# Altium project PCB_xc7z020_EvalBoard_01.PrjPcb
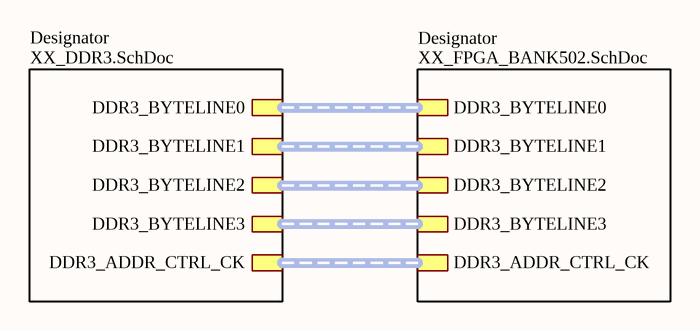
[diagram p0: 01_Main.SchDoc]
5 sheets, 51 parts. Net scope: hierarchical (ports join the sheet entries above them; power ports are global).
Board file: pcb-6layer-1oz-1.6mm.PcbDoc
Sheets:
  01_Main.SchDoc
    Designator = XX_DDR3.SchDoc
    Designator = XX_FPGA_BANK502.SchDoc
  XX_Power.SchDoc
  XX_FPGA.SchDoc

## Sheet 01_Main.SchDoc
size 594 x 420 mm; SheetNumber: 1; SheetTotal: 5

### Sub-sheets
Designator = XX_DDR3.SchDoc: DDR3_BYTELINE0 (harness DDR3_BYTELINE0), DDR3_BYTELINE1 (harness DDR3_BYTELINE1), DDR3_BYTELINE2 (harness DDR3_BYTELINE2), DDR3_BYTELINE3 (harness DDR3_BYTELINE3), DDR3_ADDR_CTRL_CK (harness DDR3_ADDR_CTRL_CK)
Designator = XX_FPGA_BANK502.SchDoc: DDR3_BYTELINE0 (harness DDR3_BYTELINE0), DDR3_BYTELINE1 (harness DDR3_BYTELINE1), DDR3_BYTELINE2 (harness DDR3_BYTELINE2), DDR3_BYTELINE3 (harness DDR3_BYTELINE3), DDR3_ADDR_CTRL_CK (harness DDR3_ADDR_CTRL_CK)

### Notes on the sheet
- Перв. примен.
- Справ. №
- Подп. и дата
- Инв. № дубл.
- Взам. инв. №
- Разраб.
- Изм.
- Лист
- № докум.
- Подп.
- Дата
- Лит.
- Масса
- Масштаб
- Пров.
- Т.контр.
- Листов
- Инв. № подл.
- Утв.
- Н.контр.
- 2.106-A2
- Копировал
- Формат А2

## Sheet XX_DDR3.SchDoc
size 594 x 420 mm; PageSetup: Record=PageOptions|CenterHorizontal=False|CenterVertical=False|PrintScale=0.95|XCorrection=0.00|YCorrection=0.00|PrintKind=1|BorderSize=5000000|LeftOffset=0|BottomOffset=0|Orientation=1|PaperLength=1000|PaperWidth=1000|Scale=100|PaperSource=15|PrintQuality=600|MediaType=1|DitherType=10|PaperKind=A4|PrintScaleMode=1; ESKD_Decimal_Number: {XXXX.XXXXXX.XXX}; Address1: Address1; Address2: Address2; Address3: Address3; Address4: Address4; DocumentNumber: АБВГ.123456.001 Э3; SheetNumber: 2; SheetTotal: 5; Scale: 1:1; DocumentType: Схема электрическая принципиальная; FirstReferrence: АБВГ.123456.001
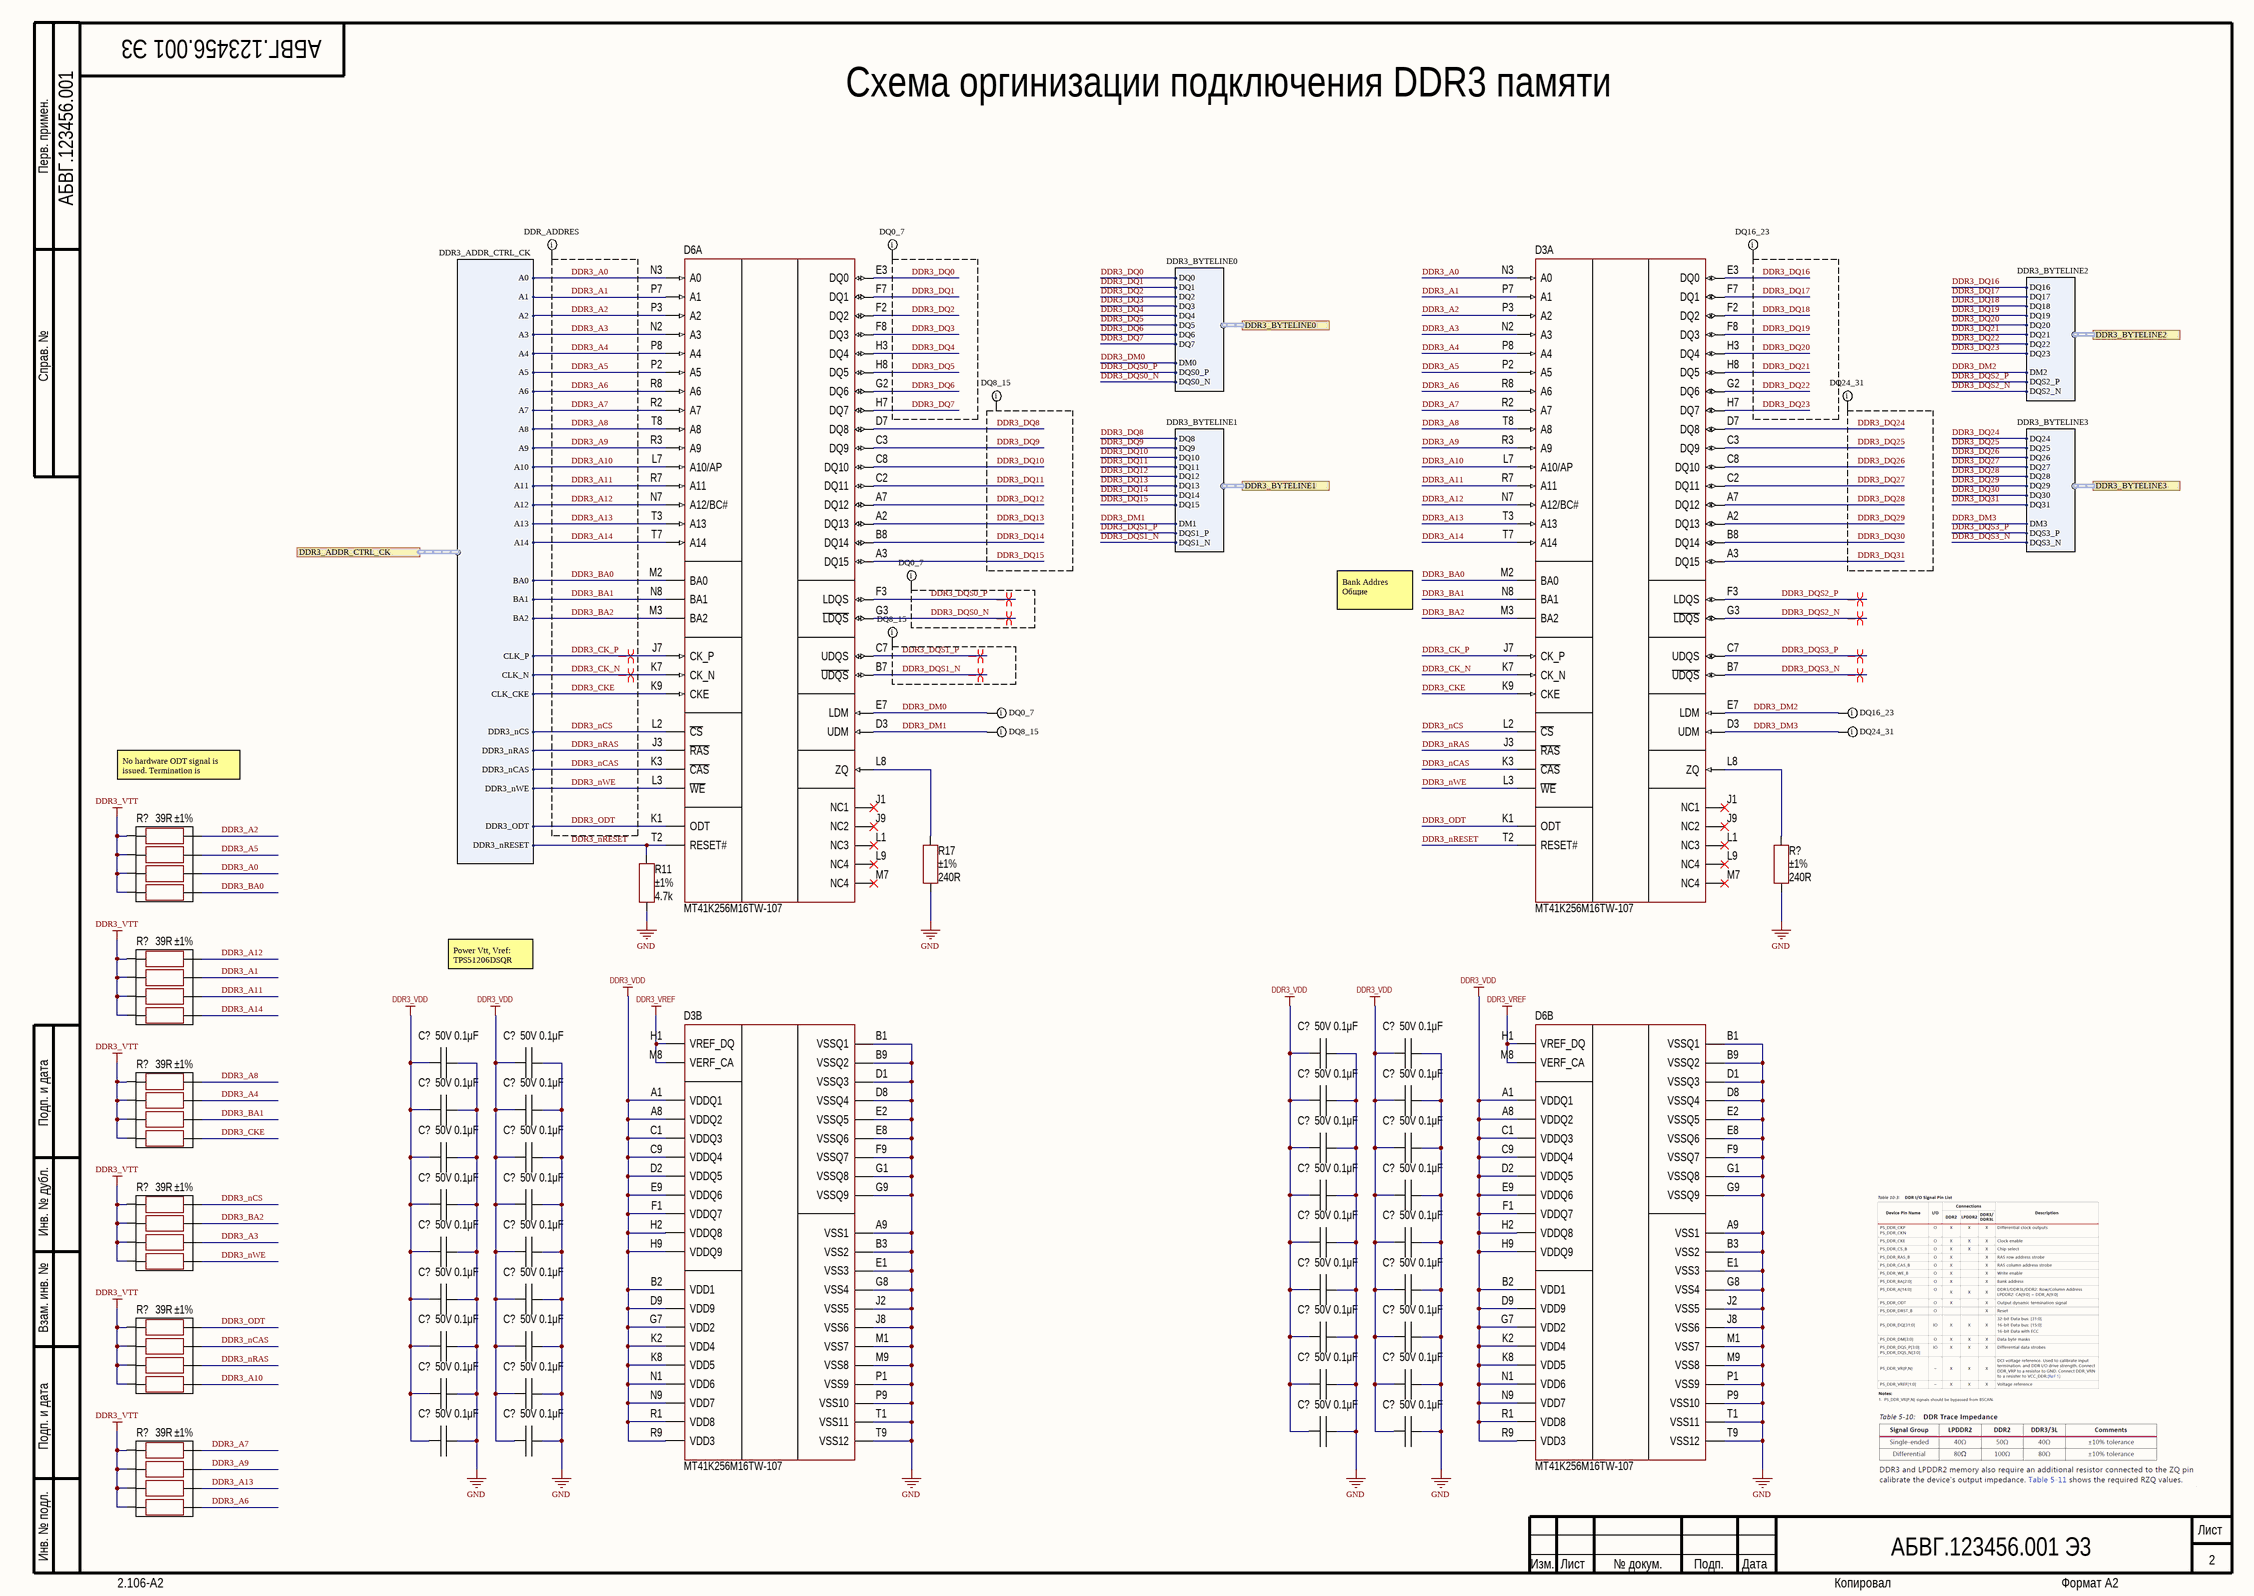
[diagram p1: XX_DDR3.SchDoc]

### Parts
(Parts that share a designator on the sheet are numbered #1, #2 ... from top to bottom, then left to right.)
C?#1  value 0.1μF  Voltage: 50V  [CAP: 0402]
C?#2  value 0.1μF  Voltage: 50V  [CAP: 0402]
C?#3  value 0.1μF  Voltage: 50V  [CAP: 0402]
C?#4  value 0.1μF  Voltage: 50V  [CAP: 0402]
C?#5  value 0.1μF  Voltage: 50V  [CAP: 0402]
C?#6  value 0.1μF  Voltage: 50V  [CAP: 0402]
C?#7  value 0.1μF  Voltage: 50V  [CAP: 0402]
C?#8  value 0.1μF  Voltage: 50V  [CAP: 0402]
C?#9  value 0.1μF  Voltage: 50V  [CAP: 0402]
C?#10  value 0.1μF  Voltage: 50V  [CAP: 0402]
C?#11  value 0.1μF  Voltage: 50V  [CAP: 0402]
C?#12  value 0.1μF  Voltage: 50V  [CAP: 0402]
C?#13  value 0.1μF  Voltage: 50V  [CAP: 0402]
C?#14  value 0.1μF  Voltage: 50V  [CAP: 0402]
C?#15  value 0.1μF  Voltage: 50V  [CAP: 0402]
C?#16  value 0.1μF  Voltage: 50V  [CAP: 0402]
C?#17  value 0.1μF  Voltage: 50V  [CAP: 0402]
C?#18  value 0.1μF  Voltage: 50V  [CAP: 0402]
C?#19  value 0.1μF  Voltage: 50V  [CAP: 0402]
C?#20  value 0.1μF  Voltage: 50V  [CAP: 0402]
C?#21  value 0.1μF  Voltage: 50V  [CAP: 0402]
C?#22  value 0.1μF  Voltage: 50V  [CAP: 0402]
C?#23  value 0.1μF  Voltage: 50V  [CAP: 0402]
C?#24  value 0.1μF  Voltage: 50V  [CAP: 0402]
C?#25  value 0.1μF  Voltage: 50V  [CAP: 0402]
C?#26  value 0.1μF  Voltage: 50V  [CAP: 0402]
C?#27  value 0.1μF  Voltage: 50V  [CAP: 0402]
C?#28  value 0.1μF  Voltage: 50V  [CAP: 0402]
C?#29  value 0.1μF  Voltage: 50V  [CAP: 0402]
C?#30  value 0.1μF  Voltage: 50V  [CAP: 0402]
C?#31  value 0.1μF  Voltage: 50V  [CAP: 0402]
C?#32  value 0.1μF  Voltage: 50V  [CAP: 0402]
C?#33  value 0.1μF  Voltage: 50V  [CAP: 0402]
C?#34  value 0.1μF  Voltage: 50V  [CAP: 0402]
C?#35  value 0.1μF  Voltage: 50V  [CAP: 0402]
C?#36  value 0.1μF  Voltage: 50V  [CAP: 0402]
D3  (no value)  [IC: FBGA96]  (parts A,B of 2)
D6  (no value)  [IC: FBGA96]  (parts A,B of 2)
R11  value 4.7k  Tolerance: ±1%  [RES: 0402]
R17  value 240R  Tolerance: ±1%  [RES: 0402]
R?#1  value 39R  Tolerance: ±1%
R?#2  value 240R  Tolerance: ±1%  [RES: 0402]
R?#3  value 39R  Tolerance: ±1%
R?#4  value 39R  Tolerance: ±1%
R?#5  value 39R  Tolerance: ±1%
R?#6  value 39R  Tolerance: ±1%
R?#7  value 39R  Tolerance: ±1%

### Ports
DDR3_ADDR_CTRL_CK (harness DDR3_ADDR_CTRL_CK), DDR3_BYTELINE0 (harness DDR3_BYTELINE0), DDR3_BYTELINE1 (harness DDR3_BYTELINE1), DDR3_BYTELINE2 (harness DDR3_BYTELINE2), DDR3_BYTELINE3 (harness DDR3_BYTELINE3)

### Harnesses
DDR3_BYTELINE0: DQ0, DQ1, DQ2, DQ3, DQ4, DQ5, DQ6, DQ7, DM0, DQS0_P, DQS0_N
DDR3_BYTELINE1: DQ8, DQ9, DQ10, DQ11, DQ12, DQ13, DQ14, DQ15, DM1, DQS1_P, DQS1_N
DDR3_BYTELINE2: DQ16, DQ17, DQ18, DQ19, DQ20, DQ21, DQ22, DQ23, DM2, DQS2_P, DQS2_N
DDR3_BYTELINE3: DQ24, DQ25, DQ26, DQ27, DQ28, DQ29, DQ30, DQ31, DM3, DQS3_P, DQS3_N
DDR3_ADDR_CTRL_CK: A0, A1, A2, A3, A4, A5, A6, A7, A8, A9, A10, A11, A12, A13, A14, BA0, BA1, BA2, CLK_P, CLK_N, CLK_CKE, DDR3_nCS, DDR3_nRAS, DDR3_nWE, DDR3_nCAS, DDR3_ODT, DDR3_nRESET

### Nets
DDR3_VDD: C?#1.2 C?#2.2 C?#3.2 C?#4.2 C?#5.2 C?#6.2 C?#7.2 C?#8.2 C?#9.2 C?#10.2 C?#11.2 C?#12.2 C?#13.2 C?#14.2 C?#15.2 C?#16.2 C?#17.2 C?#18.2 C?#19.2 C?#20.2 C?#21.2 C?#22.2 C?#23.2 C?#24.2 C?#25.2 C?#26.2 C?#27.2 C?#28.2 C?#29.2 C?#30.2 C?#31.2 C?#32.2 C?#33.2 C?#34.2 C?#35.2 C?#36.2 D3.A1(VDDQ1) D3.A8(VDDQ2) D3.B2(VDD1) D3.C1(VDDQ3) D3.C9(VDDQ4) D3.D2(VDDQ5) D3.D9(VDD9) D3.E9(VDDQ6) D3.F1(VDDQ7) D3.G7(VDD2) D3.H2(VDDQ8) D3.H9(VDDQ9) D3.K2(VDD4) D3.K8(VDD5) D3.N1(VDD6) D3.N9(VDD7) D3.R1(VDD8) D3.R9(VDD3) D6.A1(VDDQ1) D6.A8(VDDQ2) D6.B2(VDD1) D6.C1(VDDQ3) D6.C9(VDDQ4) D6.D2(VDDQ5) D6.D9(VDD9) D6.E9(VDDQ6) D6.F1(VDDQ7) D6.G7(VDD2) D6.H2(VDDQ8) D6.H9(VDDQ9) D6.K2(VDD4) D6.K8(VDD5) D6.N1(VDD6) D6.N9(VDD7) D6.R1(VDD8) D6.R9(VDD3)
DDR3_VREF: D3.H1(VREF_DQ) D3.M8(VERF_CA) D6.H1(VREF_DQ) D6.M8(VERF_CA)
DDR3_VTT: R?#1.1 R?#1.3 R?#1.5 R?#1.7 R?#3.1 R?#3.3 R?#3.5 R?#3.7 R?#4.1 R?#4.3 R?#4.5 R?#4.7 R?#5.1 R?#5.3 R?#5.5 R?#5.7 R?#6.1 R?#6.3 R?#6.5 R?#6.7 R?#7.1 R?#7.3 R?#7.5 R?#7.7
GND: C?#1.1 C?#2.1 C?#3.1 C?#4.1 C?#5.1 C?#6.1 C?#7.1 C?#8.1 C?#9.1 C?#10.1 C?#11.1 C?#12.1 C?#13.1 C?#14.1 C?#15.1 C?#16.1 C?#17.1 C?#18.1 C?#19.1 C?#20.1 C?#21.1 C?#22.1 C?#23.1 C?#24.1 C?#25.1 C?#26.1 C?#27.1 C?#28.1 C?#29.1 C?#30.1 C?#31.1 C?#32.1 C?#33.1 C?#34.1 C?#35.1 C?#36.1 D3.A9(VSS1) D3.B1(VSSQ1) D3.B3(VSS2) D3.B9(VSSQ2) D3.D1(VSSQ3) D3.D8(VSSQ4) D3.E1(VSS3) D3.E2(VSSQ5) D3.E8(VSSQ6) D3.F9(VSSQ7) D3.G1(VSSQ8) D3.G8(VSS4) D3.G9(VSSQ9) D3.J2(VSS5) D3.J8(VSS6) D3.M1(VSS7) D3.M9(VSS8) D3.P1(VSS9) D3.P9(VSS10) D3.T1(VSS11) D3.T9(VSS12) D6.A9(VSS1) D6.B1(VSSQ1) D6.B3(VSS2) D6.B9(VSSQ2) D6.D1(VSSQ3) D6.D8(VSSQ4) D6.E1(VSS3) D6.E2(VSSQ5) D6.E8(VSSQ6) D6.F9(VSSQ7) D6.G1(VSSQ8) D6.G8(VSS4) D6.G9(VSSQ9) D6.J2(VSS5) D6.J8(VSS6) D6.M1(VSS7) D6.M9(VSS8) D6.P1(VSS9) D6.P9(VSS10) D6.T1(VSS11) D6.T9(VSS12) R11.2 R17.2 R?#2.2
DDR3_A0: D3.N3(A0) D6.N3(A0) R?#1.6 ; port DDR3_ADDR_CTRL_CK.A0
DDR3_A1: D3.P7(A1) D6.P7(A1) R?#3.4 ; port DDR3_ADDR_CTRL_CK.A1
DDR3_A2: D3.P3(A2) D6.P3(A2) R?#1.2 ; port DDR3_ADDR_CTRL_CK.A2
DDR3_A3: D3.N2(A3) D6.N2(A3) R?#5.6 ; port DDR3_ADDR_CTRL_CK.A3
DDR3_A4: D3.P8(A4) D6.P8(A4) R?#4.4 ; port DDR3_ADDR_CTRL_CK.A4
DDR3_A5: D3.P2(A5) D6.P2(A5) R?#1.4 ; port DDR3_ADDR_CTRL_CK.A5
DDR3_A6: D3.R8(A6) D6.R8(A6) R?#7.8 ; port DDR3_ADDR_CTRL_CK.A6
DDR3_A7: D3.R2(A7) D6.R2(A7) R?#7.2 ; port DDR3_ADDR_CTRL_CK.A7
DDR3_A8: D3.T8(A8) D6.T8(A8) R?#4.2 ; port DDR3_ADDR_CTRL_CK.A8
DDR3_A9: D3.R3(A9) D6.R3(A9) R?#7.4 ; port DDR3_ADDR_CTRL_CK.A9
DDR3_A10: D3.L7(A10/AP) D6.L7(A10/AP) R?#6.8 ; port DDR3_ADDR_CTRL_CK.A10
DDR3_A11: D3.R7(A11) D6.R7(A11) R?#3.6 ; port DDR3_ADDR_CTRL_CK.A11
DDR3_A12: D3.N7(A12/BC#) D6.N7(A12/BC#) R?#3.2 ; port DDR3_ADDR_CTRL_CK.A12
DDR3_A13: D3.T3(A13) D6.T3(A13) R?#7.6 ; port DDR3_ADDR_CTRL_CK.A13
DDR3_A14: D3.T7(A14) D6.T7(A14) R?#3.8 ; port DDR3_ADDR_CTRL_CK.A14
DDR3_BA0: D3.M2(BA0) D6.M2(BA0) R?#1.8 ; port DDR3_ADDR_CTRL_CK.BA0
DDR3_BA1: D3.N8(BA1) D6.N8(BA1) R?#4.6 ; port DDR3_ADDR_CTRL_CK.BA1
DDR3_BA2: D3.M3(BA2) D6.M3(BA2) R?#5.4 ; port DDR3_ADDR_CTRL_CK.BA2
DDR3_CK_N: D3.K7(CK_N) D6.K7(CK_N) ; port DDR3_ADDR_CTRL_CK.CLK_N
DDR3_CK_P: D3.J7(CK_P) D6.J7(CK_P) ; port DDR3_ADDR_CTRL_CK.CLK_P
DDR3_CKE: D3.K9(CKE) D6.K9(CKE) R?#4.8 ; port DDR3_ADDR_CTRL_CK.CLK_CKE
DDR3_DM0: D6.E7(LDM) ; port DDR3_BYTELINE0.DM0
DDR3_DM1: D6.D3(UDM) ; port DDR3_BYTELINE1.DM1
DDR3_DM2: D3.E7(LDM) ; port DDR3_BYTELINE2.DM2
DDR3_DM3: D3.D3(UDM) ; port DDR3_BYTELINE3.DM3
DDR3_DQ0: D6.E3(DQ0) ; port DDR3_BYTELINE0.DQ0
DDR3_DQ1: D6.F7(DQ1) ; port DDR3_BYTELINE0.DQ1
DDR3_DQ2: D6.F2(DQ2) ; port DDR3_BYTELINE0.DQ2
DDR3_DQ3: D6.F8(DQ3) ; port DDR3_BYTELINE0.DQ3
DDR3_DQ4: D6.H3(DQ4) ; port DDR3_BYTELINE0.DQ4
DDR3_DQ5: D6.H8(DQ5) ; port DDR3_BYTELINE0.DQ5
DDR3_DQ6: D6.G2(DQ6) ; port DDR3_BYTELINE0.DQ6
DDR3_DQ7: D6.H7(DQ7) ; port DDR3_BYTELINE0.DQ7
DDR3_DQ8: D6.D7(DQ8) ; port DDR3_BYTELINE1.DQ8
DDR3_DQ9: D6.C3(DQ9) ; port DDR3_BYTELINE1.DQ9
DDR3_DQ10: D6.C8(DQ10) ; port DDR3_BYTELINE1.DQ10
DDR3_DQ11: D6.C2(DQ11) ; port DDR3_BYTELINE1.DQ11
DDR3_DQ12: D6.A7(DQ12) ; port DDR3_BYTELINE1.DQ12
DDR3_DQ13: D6.A2(DQ13) ; port DDR3_BYTELINE1.DQ13
DDR3_DQ14: D6.B8(DQ14) ; port DDR3_BYTELINE1.DQ14
DDR3_DQ15: D6.A3(DQ15) ; port DDR3_BYTELINE1.DQ15
DDR3_DQ16: D3.E3(DQ0) ; port DDR3_BYTELINE2.DQ16
DDR3_DQ17: D3.F7(DQ1) ; port DDR3_BYTELINE2.DQ17
DDR3_DQ18: D3.F2(DQ2) ; port DDR3_BYTELINE2.DQ18
DDR3_DQ19: D3.F8(DQ3) ; port DDR3_BYTELINE2.DQ19
DDR3_DQ20: D3.H3(DQ4) ; port DDR3_BYTELINE2.DQ20
DDR3_DQ21: D3.H8(DQ5) ; port DDR3_BYTELINE2.DQ21
DDR3_DQ22: D3.G2(DQ6) ; port DDR3_BYTELINE2.DQ22
DDR3_DQ23: D3.H7(DQ7) ; port DDR3_BYTELINE2.DQ23
DDR3_DQ24: D3.D7(DQ8) ; port DDR3_BYTELINE3.DQ24
DDR3_DQ25: D3.C3(DQ9) ; port DDR3_BYTELINE3.DQ25
DDR3_DQ26: D3.C8(DQ10) ; port DDR3_BYTELINE3.DQ26
DDR3_DQ27: D3.C2(DQ11) ; port DDR3_BYTELINE3.DQ27
DDR3_DQ28: D3.A7(DQ12) ; port DDR3_BYTELINE3.DQ28
DDR3_DQ29: D3.A2(DQ13) ; port DDR3_BYTELINE3.DQ29
DDR3_DQ30: D3.B8(DQ14) ; port DDR3_BYTELINE3.DQ30
DDR3_DQ31: D3.A3(DQ15) ; port DDR3_BYTELINE3.DQ31
DDR3_DQS0_N: D6.G3(~{LDQS}) ; port DDR3_BYTELINE0.DQS0_N
DDR3_DQS0_P: D6.F3(LDQS) ; port DDR3_BYTELINE0.DQS0_P
DDR3_DQS1_N: D6.B7(~{UDQS}) ; port DDR3_BYTELINE1.DQS1_N
DDR3_DQS1_P: D6.C7(UDQS) ; port DDR3_BYTELINE1.DQS1_P
DDR3_DQS2_N: D3.G3(~{LDQS}) ; port DDR3_BYTELINE2.DQS2_N
DDR3_DQS2_P: D3.F3(LDQS) ; port DDR3_BYTELINE2.DQS2_P
DDR3_DQS3_N: D3.B7(~{UDQS}) ; port DDR3_BYTELINE3.DQS3_N
DDR3_DQS3_P: D3.C7(UDQS) ; port DDR3_BYTELINE3.DQS3_P
DDR3_nCAS: D3.K3(~{CAS}) D6.K3(~{CAS}) R?#6.4 ; port DDR3_ADDR_CTRL_CK.DDR3_nCAS
DDR3_nCS: D3.L2(~{CS}) D6.L2(~{CS}) R?#5.2 ; port DDR3_ADDR_CTRL_CK.DDR3_nCS
DDR3_nRAS: D3.J3(~{RAS}) D6.J3(~{RAS}) R?#6.6 ; port DDR3_ADDR_CTRL_CK.DDR3_nRAS
DDR3_nRESET: D3.T2(RESET#) D6.T2(RESET#) R11.1 ; port DDR3_ADDR_CTRL_CK.DDR3_nRESET
DDR3_nWE: D3.L3(~{WE}) D6.L3(~{WE}) R?#5.8 ; port DDR3_ADDR_CTRL_CK.DDR3_nWE
DDR3_ODT: D3.K1(ODT) D6.K1(ODT) R?#6.2 ; port DDR3_ADDR_CTRL_CK.DDR3_ODT
NetD3_L8: D3.L8(ZQ) R?#2.1
NetD6_L8: D6.L8(ZQ) R17.1

Not connected (* = marked no-connect by the designer): D3 J1(NC1)* J9(NC2)* L1(NC3)* L9(NC4)* M7(NC4)*; D6 J1(NC1)* J9(NC2)* L1(NC3)* L9(NC4)* M7(NC4)*

### Layout directives
differential pair: DDR3_CK_N, DDR3_CK_P, DDR3_DQS0_N, DDR3_DQS0_P, DDR3_DQS1_N, DDR3_DQS1_P, DDR3_DQS2_N, DDR3_DQS2_P, DDR3_DQS3_N, DDR3_DQS3_P
net class DDR_ADDRES: DDR3_A0, DDR3_A1, DDR3_A2, DDR3_A3, DDR3_A4, DDR3_A5, DDR3_A6, DDR3_A7, DDR3_A8, DDR3_A9, DDR3_A10, DDR3_A11, DDR3_A12, DDR3_A13, DDR3_A14, DDR3_BA0, DDR3_BA1, DDR3_BA2, DDR3_CK_N, DDR3_CK_P, DDR3_CKE, DDR3_nCAS, DDR3_nCS, DDR3_nRAS, DDR3_nWE, DDR3_ODT
net class DQ0_7: DDR3_DM0, DDR3_DQ0, DDR3_DQ1, DDR3_DQ2, DDR3_DQ3, DDR3_DQ4, DDR3_DQ5, DDR3_DQ6, DDR3_DQ7, DDR3_DQS0_N, DDR3_DQS0_P
net class DQ8_15: DDR3_DM1, DDR3_DQ8, DDR3_DQ9, DDR3_DQ10, DDR3_DQ11, DDR3_DQ12, DDR3_DQ13, DDR3_DQ14, DDR3_DQ15, DDR3_DQS1_N, DDR3_DQS1_P
net class DQ16_23: DDR3_DM2, DDR3_DQ16, DDR3_DQ17, DDR3_DQ18, DDR3_DQ19, DDR3_DQ20, DDR3_DQ21, DDR3_DQ22, DDR3_DQ23
net class DQ24_31: DDR3_DM3, DDR3_DQ24, DDR3_DQ25, DDR3_DQ26, DDR3_DQ27, DDR3_DQ28, DDR3_DQ29, DDR3_DQ30, DDR3_DQ31

### Notes on the sheet
- Схема оргинизации подключения DDR3 памяти
- Bank Addres
  Общие
- No hardware ODT signal is issued. Termination is command base
- Power Vtt, Vref:
  TPS51206DSQR
- Перв. примен.
- Справ. №
- Подп. и дата
- Инв. № дубл.
- Взам. инв. №
- Инв. № подл.
- Изм.
- Лист
- № докум.
- Подп.
- Дата
- 2.106-A2
- Копировал
- Формат А2

### Library data of the parts
C?#1-C?#36 = Ceramic_0402: Manufacturer: Murata Electronics; PartNumber: GRM155R71H104KE14D; ValueManufacturerPartNumber: Ceramic capacitor, 0.1μF, X7R, ±10%, 50V, 0402, -55...+125°C; TypeCapacitor: Ceramic capacitor; Tolerance: ±10%; TypeDielectric: X7R; Package: 0402; HelpURL: https://www.lcsc.com/product-detail/Multilayer-Ceramic-Capacitors-MLCC-SMD-SMT_Murata-Electronics-GRM155R71H104KE14D_C77020.html; Temperature: -55...+125°C
D3 D6 = MT41K256M16TW-107: DDR3L SDRAM; Manufacturer: Micron Tech; ValueManufacturerPartNumber: DDR3L SDRAM, DDR3, 128Mb (8M x 16), 166 MHz, Parallel, 3...3.6V, 0...+70°C, FBGA-96; Supply: 3...3.6V; Speed: 166 MHz; InterfaceData: Parallel; MemorySize: 128Mb (8M x 16); MemoryType: DDR3; HelpURL: https://www.lcsc.com/product-detail/DDR-SDRAM_Micron-Tech-MT41K256M16TW-107-IT-P_C367428.html; Package: FBGA-96; ComponentType: DDR3L SDRAM; Temperature: 0...+70°C; PartNumber: MT41K256M16TW-107
R11 = Resistor_0402: Manufacturer: Yageo; PartNumber: RC0402FR-074K7L; ValueManufacturerPartNumber: Resistor film, 4.7k, ±1%, 0402, 0.063W, -55...+125°C; TypeResistor: Resistor film; Power: 0.063W; Package: 0402; HelpURL: https://www.lcsc.com/product-detail/Chip-Resistor-Surface-Mount_YAGEO-RC0402FR-074K7L_C105871.html; Temperature: -55...+125°C
R17 R?#2 = Resistor_0603: Manufacturer: Yageo; PartNumber: RC0603JR-07100RL; ValueManufacturerPartNumber: Resistor film, 240R, ±1%, 0603, 0.1W, -55...+125°C; TypeResistor: Resistor film; Power: 0.1W; Package: 0603; HelpURL: https://www.digikey.com/product-detail/en/yageo/RC0603JR-07100RL/311-100GRCT-ND/729644; Temperature: -55...+125°C
R?#1 R?#3-R?#7 = Resistor_0402_Array: Manufacturer: Yageo; PartNumber: YC164-FR-0739RL; ValueManufacturerPartNumber: Resistor film, 39R, ±1%, 0402x4, 0.063W, -55...+125°C; TypeResistor: Resistor film; Power: 0.063W; Package: 0402x4; HelpURL: https://www.lcsc.com/product-detail/Resistor-Networks-Arrays_YAGEO-YC164-FR-0739RL_C309682.html; Temperature: -55...+125°C

## Sheet XX_FPGA_BANK502.SchDoc
size 420 x 297 mm; Address1: Address1; Address2: Address2; Address3: Address3; Address4: Address4; DocumentNumber: АБВГ.123456.001 Э3; SheetNumber: 3; SheetTotal: 5; Scale: 1:1; DocumentType: Схема электрическая принципиальная; FirstReferrence: АБВГ.123456.001
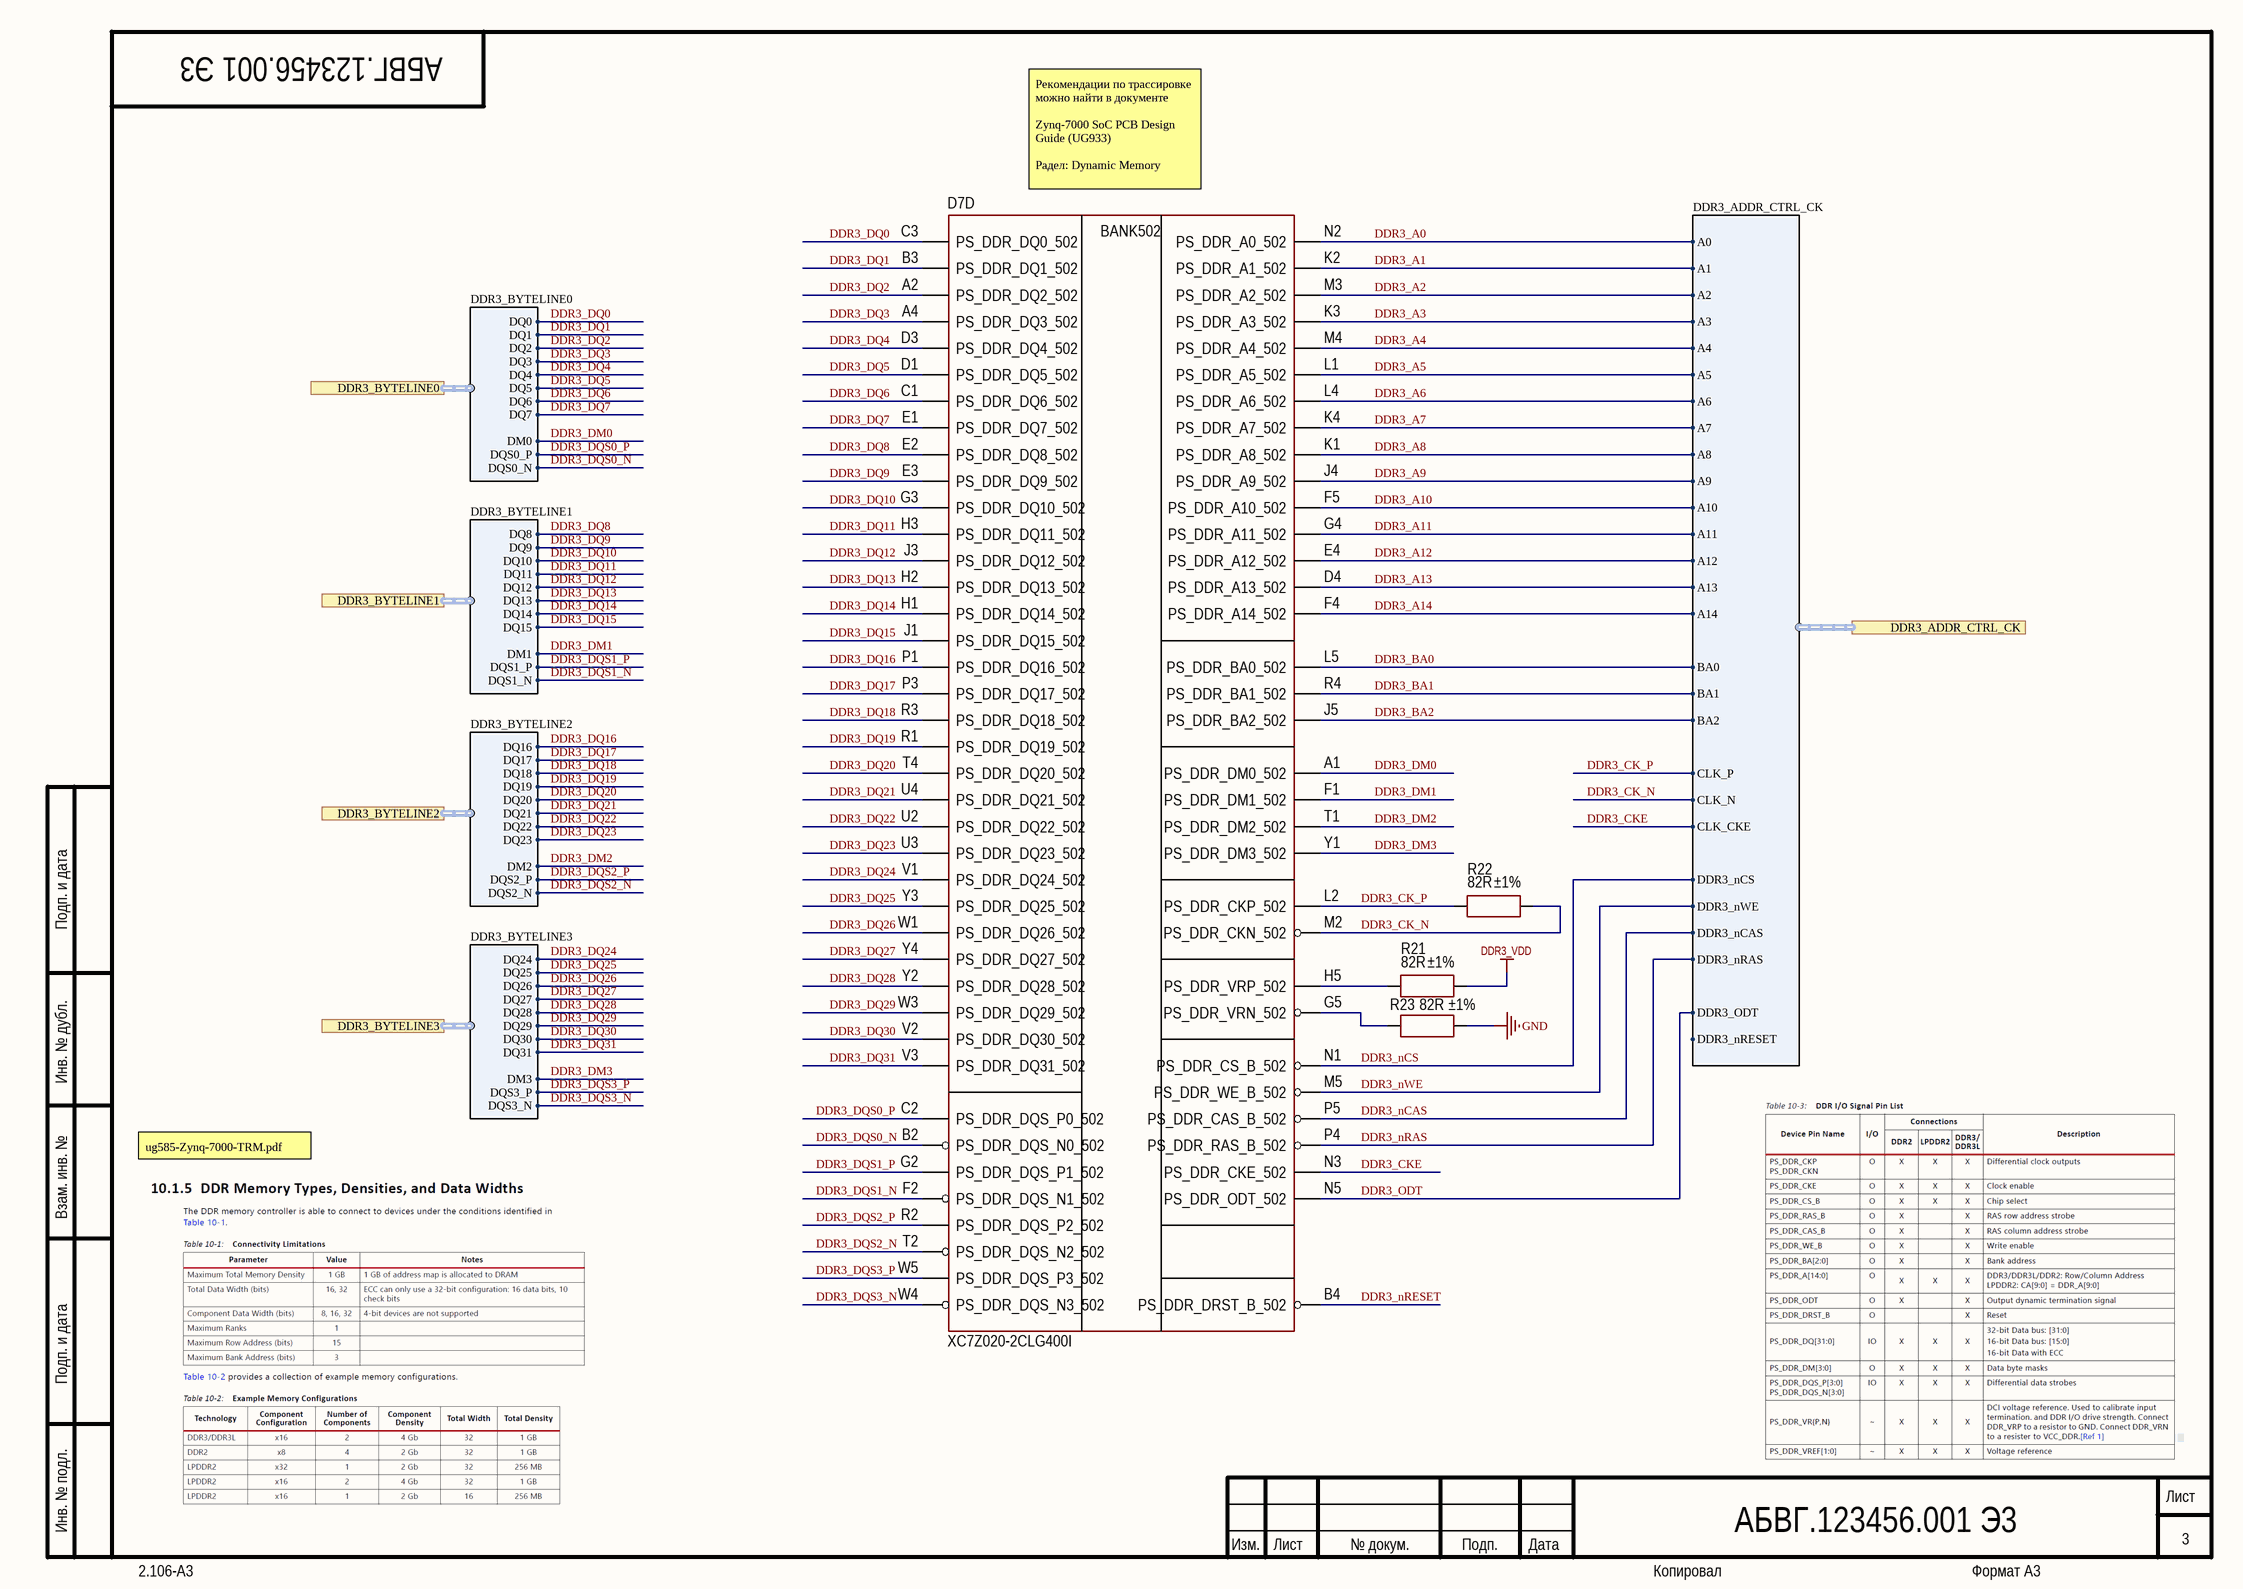
[diagram p2: XX_FPGA_BANK502.SchDoc]

### Parts
D7  PartNumber: XC7Z020-2CLG400I  [IC:BGA400C80P20X20_1700X1700X147]  (part D of 9)
R21  value 82R  Tolerance: ±1%  [RES: 0402]
R22  value 82R  Tolerance: ±1%  [RES: 0402]
R23  value 82R  Tolerance: ±1%  [RES: 0402]

### Ports
DDR3_ADDR_CTRL_CK (harness DDR3_ADDR_CTRL_CK), DDR3_BYTELINE0 (harness DDR3_BYTELINE0), DDR3_BYTELINE1 (harness DDR3_BYTELINE1), DDR3_BYTELINE2 (harness DDR3_BYTELINE2), DDR3_BYTELINE3 (harness DDR3_BYTELINE3)

### Harnesses
DDR3_BYTELINE0: DQ0, DQ1, DQ2, DQ3, DQ4, DQ5, DQ6, DQ7, DM0, DQS0_P, DQS0_N
DDR3_BYTELINE1: DQ8, DQ9, DQ10, DQ11, DQ12, DQ13, DQ14, DQ15, DM1, DQS1_P, DQS1_N
DDR3_BYTELINE2: DQ16, DQ17, DQ18, DQ19, DQ20, DQ21, DQ22, DQ23, DM2, DQS2_P, DQS2_N
DDR3_BYTELINE3: DQ24, DQ25, DQ26, DQ27, DQ28, DQ29, DQ30, DQ31, DM3, DQS3_P, DQS3_N
DDR3_ADDR_CTRL_CK: A0, A1, A2, A3, A4, A5, A6, A7, A8, A9, A10, A11, A12, A13, A14, BA0, BA1, BA2, CLK_P, CLK_N, CLK_CKE, DDR3_nCS, DDR3_nRAS, DDR3_nWE, DDR3_nCAS, DDR3_ODT, DDR3_nRESET

### Nets
DDR3_VDD: R21.1
GND: R23.2
DDR3_A0: D7.N2(PS_DDR_A0_502) ; port DDR3_ADDR_CTRL_CK.A0
DDR3_A1: D7.K2(PS_DDR_A1_502) ; port DDR3_ADDR_CTRL_CK.A1
DDR3_A2: D7.M3(PS_DDR_A2_502) ; port DDR3_ADDR_CTRL_CK.A2
DDR3_A3: D7.K3(PS_DDR_A3_502) ; port DDR3_ADDR_CTRL_CK.A3
DDR3_A4: D7.M4(PS_DDR_A4_502) ; port DDR3_ADDR_CTRL_CK.A4
DDR3_A5: D7.L1(PS_DDR_A5_502) ; port DDR3_ADDR_CTRL_CK.A5
DDR3_A6: D7.L4(PS_DDR_A6_502) ; port DDR3_ADDR_CTRL_CK.A6
DDR3_A7: D7.K4(PS_DDR_A7_502) ; port DDR3_ADDR_CTRL_CK.A7
DDR3_A8: D7.K1(PS_DDR_A8_502) ; port DDR3_ADDR_CTRL_CK.A8
DDR3_A9: D7.J4(PS_DDR_A9_502) ; port DDR3_ADDR_CTRL_CK.A9
DDR3_A10: D7.F5(PS_DDR_A10_502) ; port DDR3_ADDR_CTRL_CK.A10
DDR3_A11: D7.G4(PS_DDR_A11_502) ; port DDR3_ADDR_CTRL_CK.A11
DDR3_A12: D7.E4(PS_DDR_A12_502) ; port DDR3_ADDR_CTRL_CK.A12
DDR3_A13: D7.D4(PS_DDR_A13_502) ; port DDR3_ADDR_CTRL_CK.A13
DDR3_A14: D7.F4(PS_DDR_A14_502) ; port DDR3_ADDR_CTRL_CK.A14
DDR3_BA0: D7.L5(PS_DDR_BA0_502) ; port DDR3_ADDR_CTRL_CK.BA0
DDR3_BA1: D7.R4(PS_DDR_BA1_502) ; port DDR3_ADDR_CTRL_CK.BA1
DDR3_BA2: D7.J5(PS_DDR_BA2_502) ; port DDR3_ADDR_CTRL_CK.BA2
DDR3_CK_N: D7.M2(PS_DDR_CKN_502) R22.1 ; port DDR3_ADDR_CTRL_CK.CLK_N
DDR3_CK_P: D7.L2(PS_DDR_CKP_502) R22.2 ; port DDR3_ADDR_CTRL_CK.CLK_P
DDR3_CKE: D7.N3(PS_DDR_CKE_502) ; port DDR3_ADDR_CTRL_CK.CLK_CKE
DDR3_DM0: D7.A1(PS_DDR_DM0_502) ; port DDR3_BYTELINE0.DM0
DDR3_DM1: D7.F1(PS_DDR_DM1_502) ; port DDR3_BYTELINE1.DM1
DDR3_DM2: D7.T1(PS_DDR_DM2_502) ; port DDR3_BYTELINE2.DM2
DDR3_DM3: D7.Y1(PS_DDR_DM3_502) ; port DDR3_BYTELINE3.DM3
DDR3_DQ0: D7.C3(PS_DDR_DQ0_502) ; port DDR3_BYTELINE0.DQ0
DDR3_DQ1: D7.B3(PS_DDR_DQ1_502) ; port DDR3_BYTELINE0.DQ1
DDR3_DQ2: D7.A2(PS_DDR_DQ2_502) ; port DDR3_BYTELINE0.DQ2
DDR3_DQ3: D7.A4(PS_DDR_DQ3_502) ; port DDR3_BYTELINE0.DQ3
DDR3_DQ4: D7.D3(PS_DDR_DQ4_502) ; port DDR3_BYTELINE0.DQ4
DDR3_DQ5: D7.D1(PS_DDR_DQ5_502) ; port DDR3_BYTELINE0.DQ5
DDR3_DQ6: D7.C1(PS_DDR_DQ6_502) ; port DDR3_BYTELINE0.DQ6
DDR3_DQ7: D7.E1(PS_DDR_DQ7_502) ; port DDR3_BYTELINE0.DQ7
DDR3_DQ8: D7.E2(PS_DDR_DQ8_502) ; port DDR3_BYTELINE1.DQ8
DDR3_DQ9: D7.E3(PS_DDR_DQ9_502) ; port DDR3_BYTELINE1.DQ9
DDR3_DQ10: D7.G3(PS_DDR_DQ10_502) ; port DDR3_BYTELINE1.DQ10
DDR3_DQ11: D7.H3(PS_DDR_DQ11_502) ; port DDR3_BYTELINE1.DQ11
DDR3_DQ12: D7.J3(PS_DDR_DQ12_502) ; port DDR3_BYTELINE1.DQ12
DDR3_DQ13: D7.H2(PS_DDR_DQ13_502) ; port DDR3_BYTELINE1.DQ13
DDR3_DQ14: D7.H1(PS_DDR_DQ14_502) ; port DDR3_BYTELINE1.DQ14
DDR3_DQ15: D7.J1(PS_DDR_DQ15_502) ; port DDR3_BYTELINE1.DQ15
DDR3_DQ16: D7.P1(PS_DDR_DQ16_502) ; port DDR3_BYTELINE2.DQ16
DDR3_DQ17: D7.P3(PS_DDR_DQ17_502) ; port DDR3_BYTELINE2.DQ17
DDR3_DQ18: D7.R3(PS_DDR_DQ18_502) ; port DDR3_BYTELINE2.DQ18
DDR3_DQ19: D7.R1(PS_DDR_DQ19_502) ; port DDR3_BYTELINE2.DQ19
DDR3_DQ20: D7.T4(PS_DDR_DQ20_502) ; port DDR3_BYTELINE2.DQ20
DDR3_DQ21: D7.U4(PS_DDR_DQ21_502) ; port DDR3_BYTELINE2.DQ21
DDR3_DQ22: D7.U2(PS_DDR_DQ22_502) ; port DDR3_BYTELINE2.DQ22
DDR3_DQ23: D7.U3(PS_DDR_DQ23_502) ; port DDR3_BYTELINE2.DQ23
DDR3_DQ24: D7.V1(PS_DDR_DQ24_502) ; port DDR3_BYTELINE3.DQ24
DDR3_DQ25: D7.Y3(PS_DDR_DQ25_502) ; port DDR3_BYTELINE3.DQ25
DDR3_DQ26: D7.W1(PS_DDR_DQ26_502) ; port DDR3_BYTELINE3.DQ26
DDR3_DQ27: D7.Y4(PS_DDR_DQ27_502) ; port DDR3_BYTELINE3.DQ27
DDR3_DQ28: D7.Y2(PS_DDR_DQ28_502) ; port DDR3_BYTELINE3.DQ28
DDR3_DQ29: D7.W3(PS_DDR_DQ29_502) ; port DDR3_BYTELINE3.DQ29
DDR3_DQ30: D7.V2(PS_DDR_DQ30_502) ; port DDR3_BYTELINE3.DQ30
DDR3_DQ31: D7.V3(PS_DDR_DQ31_502) ; port DDR3_BYTELINE3.DQ31
DDR3_DQS0_N: D7.B2(PS_DDR_DQS_N0_502) ; port DDR3_BYTELINE0.DQS0_N
DDR3_DQS0_P: D7.C2(PS_DDR_DQS_P0_502) ; port DDR3_BYTELINE0.DQS0_P
DDR3_DQS1_N: D7.F2(PS_DDR_DQS_N1_502) ; port DDR3_BYTELINE1.DQS1_N
DDR3_DQS1_P: D7.G2(PS_DDR_DQS_P1_502) ; port DDR3_BYTELINE1.DQS1_P
DDR3_DQS2_N: D7.T2(PS_DDR_DQS_N2_502) ; port DDR3_BYTELINE2.DQS2_N
DDR3_DQS2_P: D7.R2(PS_DDR_DQS_P2_502) ; port DDR3_BYTELINE2.DQS2_P
DDR3_DQS3_N: D7.W4(PS_DDR_DQS_N3_502) ; port DDR3_BYTELINE3.DQS3_N
DDR3_DQS3_P: D7.W5(PS_DDR_DQS_P3_502) ; port DDR3_BYTELINE3.DQS3_P
DDR3_nCAS: D7.P5(PS_DDR_CAS_B_502) ; port DDR3_ADDR_CTRL_CK.DDR3_nCAS
DDR3_nCS: D7.N1(PS_DDR_CS_B_502) ; port DDR3_ADDR_CTRL_CK.DDR3_nCS
DDR3_nRAS: D7.P4(PS_DDR_RAS_B_502) ; port DDR3_ADDR_CTRL_CK.DDR3_nRAS
DDR3_nRESET: D7.B4(PS_DDR_DRST_B_502)
DDR3_nWE: D7.M5(PS_DDR_WE_B_502) ; port DDR3_ADDR_CTRL_CK.DDR3_nWE
DDR3_ODT: D7.N5(PS_DDR_ODT_502) ; port DDR3_ADDR_CTRL_CK.DDR3_ODT
NetD7_G5: D7.G5(PS_DDR_VRN_502) R23.1
NetD7_H5: D7.H5(PS_DDR_VRP_502) R21.2

### Notes on the sheet
- (near D7) Рекомендации по трассировке можно найти в документе
  Zynq-7000 SoC PCB Design Guide (UG933)
  Радел: Dynamic Memory
- ug585-Zynq-7000-TRM.pdf
- Подп. и дата
- Инв. № дубл.
- Взам. инв. №
- Инв. № подл.
- Изм.
- Лист
- № докум.
- Подп.
- Дата
- 2.106-A3
- Копировал
- Формат А3
- (in symbol XC7Z020_CLG400ABX22, part D) BANK502

### Library data of the parts
D7 = XC7Z020_CLG400ABX22: FPGA XILINX Zynq XC7Z020; Manufacturer: AMD/XILINX; ValueManufacturerPartNumber: IC FPGA, Zynq, , , , 1.15...1.25V, 0...+85°C, CSPBGA-400; Supply: 1.15...1.25V; HelpURL: https://www.lcsc.com/product-detail/Programmable-Logic-Device-CPLDs-FPGAs_AMD-XILINX-XC7Z020-2CLG400I_C569043.html; Package: CSPBGA-400; ComponentType: IC FPGA; Temperature: 0...+85°C; Series: Zynq
R21-R23 = Resistor_0402: Manufacturer: Yageo; PartNumber: RC0402FR-0782RL; ValueManufacturerPartNumber: Resistor film, 82R, ±1%, 0402, 0.063W, -55...+125°C; TypeResistor: Resistor film; Power: 0.063W; Package: 0402; HelpURL: https://www.lcsc.com/product-detail/Chip-Resistor-Surface-Mount_YAGEO-RC0402FR-0782RL_C163453.html; Temperature: -55...+125°C

## Sheet XX_Power.SchDoc
size 840 x 594 mm; PageSetup: Record=PageOptions|CenterHorizontal=False|CenterVertical=False|PrintScale=0.95|XCorrection=0.00|YCorrection=0.00|PrintKind=1|BorderSize=5000000|LeftOffset=0|BottomOffset=0|Orientation=1|PaperLength=1000|PaperWidth=1000|Scale=100|PaperSource=15|PrintQuality=600|MediaType=1|DitherType=10|PaperKind=A4|PrintScaleMode=1; ESKD_Decimal_Number: {XXXX.XXXXXX.XXX}; ESKD_Document_Name: {Наименование документа}; ESKD_Pervichnoe_Primenenie: {Первичное наименование}; ESKD_T_Kontr: {Т.Контр}; ESKD_N_Kontr: {Н.Контр}; ESKD_Utverdil: {Утвердил}; ESKD_Organizaciya: {Организация}; ESKD_Proveril: {Проверил}; ESKD_Razrabotal: {Разработал}; Address1: Address1; Address2: Address2; Address3: Address3; Address4: Address4; DocumentNumber: АБВГ.123456.001 Э3; SheetNumber: 4; SheetTotal: 7; Scale: 1:1; DocumentType: Схема электрическая принципиальная; FirstReferrence: АБВГ.123456.001
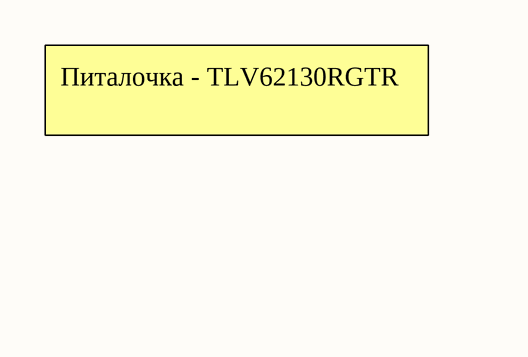
[diagram p3: XX_Power.SchDoc]

### Notes on the sheet
- Питалочка - TLV62130RGTR
- Перв. примен.
- Справ. №
- Подп. и дата
- Инв. № дубл.
- Взам. инв. №
- Инв. № подл.
- Изм.
- Лист
- № докум.
- Подп.
- Дата
- 2.106-A2
- Копировал
- Формат А1

## Sheet XX_FPGA.SchDoc
size 840 x 594 mm; ESKD_Decimal_Number: {XXXX.XXXXXX.XXX}; ESKD_Document_Name: {Наименование документа}; ESKD_Pervichnoe_Primenenie: {Первичное наименование}; Address1: Address1; Address2: Address2; Address3: Address3; Address4: Address4; DocumentNumber: АБВГ.123456.001 Э3; SheetNumber: 7; SheetTotal: 7; Scale: 1:1; DocumentType: Схема электрическая принципиальная; FirstReferrence: АБВГ.123456.001
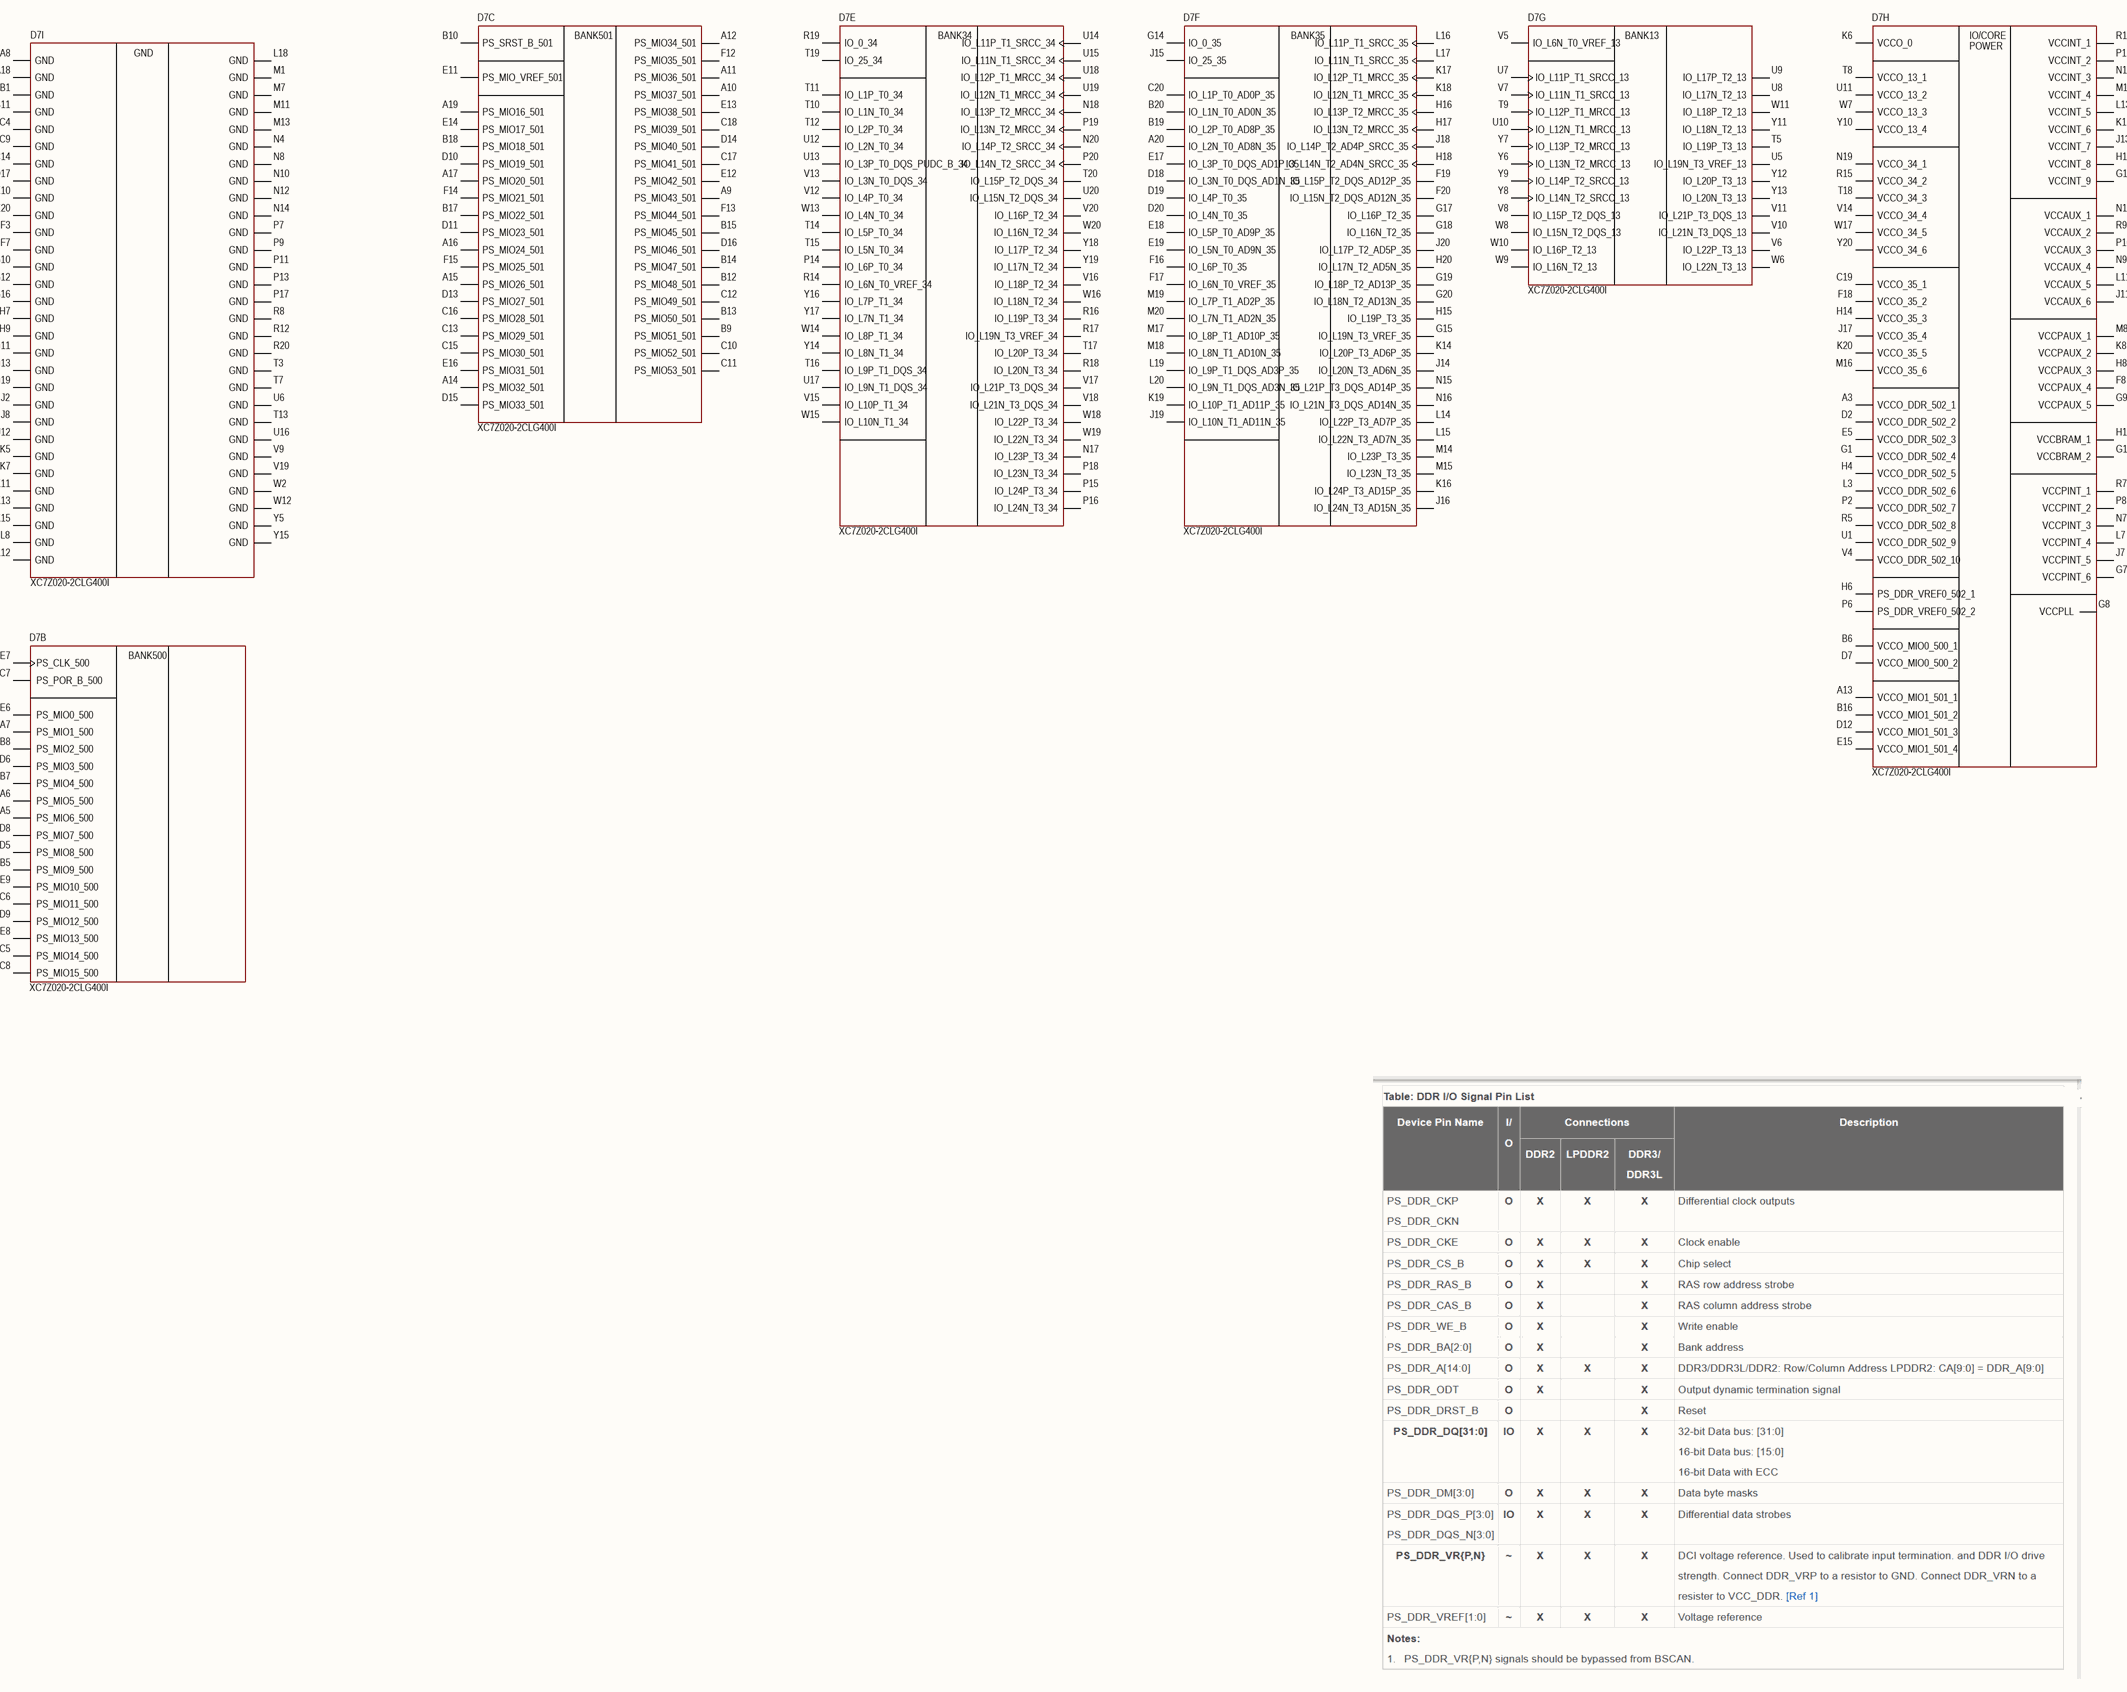
[diagram p4: XX_FPGA.SchDoc]

### Parts
D7  PartNumber: XC7Z020-2CLG400I  [IC:BGA400C80P20X20_1700X1700X147]  (parts B,C,E,F,G,H,I of 9)

### Nets

Not connected (* = marked no-connect by the designer): D7 A3(VCCO_DDR_502_1) A5(PS_MIO6_500) A6(PS_MIO5_500) A7(PS_MIO1_500) A8(GND) A9(PS_MIO43_501) A10(PS_MIO37_501) A11(PS_MIO36_501) A12(PS_MIO34_501) A13(VCCO_MIO1_501_1) A14(PS_MIO32_501) A15(PS_MIO26_501) A16(PS_MIO24_501) A17(PS_MIO20_501) A18(GND) A19(PS_MIO16_501) A20(IO_L2N_T0_AD8N_35) B1(GND) B5(PS_MIO9_500) B6(VCCO_MIO0_500_1) B7(PS_MIO4_500) B8(PS_MIO2_500) B9(PS_MIO51_501) B10(PS_SRST_B_501) B11(GND) B12(PS_MIO48_501) B13(PS_MIO50_501) B14(PS_MIO47_501) B15(PS_MIO45_501) B16(VCCO_MIO1_501_2) B17(PS_MIO22_501) B18(PS_MIO18_501) B19(IO_L2P_T0_AD8P_35) B20(IO_L1N_T0_AD0N_35) C4(GND) C5(PS_MIO14_500) C6(PS_MIO11_500) C7(PS_POR_B_500) C8(PS_MIO15_500) C9(GND) C10(PS_MIO52_501) C11(PS_MIO53_501) C12(PS_MIO49_501) C13(PS_MIO29_501) C14(GND) C15(PS_MIO30_501) C16(PS_MIO28_501) C17(PS_MIO41_501) C18(PS_MIO39_501) C19(VCCO_35_1) C20(IO_L1P_T0_AD0P_35) D2(VCCO_DDR_502_2) D5(PS_MIO8_500) D6(PS_MIO3_500) D7(VCCO_MIO0_500_2) D8(PS_MIO7_500) D9(PS_MIO12_500) D10(PS_MIO19_501) D11(PS_MIO23_501) D12(VCCO_MIO1_501_3) D13(PS_MIO27_501) D14(PS_MIO40_501) D15(PS_MIO33_501) D16(PS_MIO46_501) D17(GND) D18(IO_L3N_T0_DQS_AD1N_35) D19(IO_L4P_T0_35) D20(IO_L4N_T0_35) E5(VCCO_DDR_502_3) E6(PS_MIO0_500) E7(PS_CLK_500) E8(PS_MIO13_500) E9(PS_MIO10_500) E10(GND) E11(PS_MIO_VREF_501) E12(PS_MIO42_501) E13(PS_MIO38_501) E14(PS_MIO17_501) E15(VCCO_MIO1_501_4) E16(PS_MIO31_501) E17(IO_L3P_T0_DQS_AD1P_35) E18(IO_L5P_T0_AD9P_35) E19(IO_L5N_T0_AD9N_35) E20(GND) F3(GND) F7(GND) F8(VCCPAUX_4) F12(PS_MIO35_501) F13(PS_MIO44_501) F14(PS_MIO21_501) F15(PS_MIO25_501) F16(IO_L6P_T0_35) F17(IO_L6N_T0_VREF_35) F18(VCCO_35_2) F19(IO_L15P_T2_DQS_AD12P_35) F20(IO_L15N_T2_DQS_AD12N_35) G1(VCCO_DDR_502_4) G7(VCCPINT_6) G8(VCCPLL) G9(VCCPAUX_5) G10(GND) G11(VCCBRAM_2) G12(GND) G13(VCCINT_9) G14(IO_0_35) G15(IO_L19N_T3_VREF_35) G16(GND) G17(IO_L16P_T2_35) G18(IO_L16N_T2_35) G19(IO_L18P_T2_AD13P_35) G20(IO_L18N_T2_AD13N_35) H4(VCCO_DDR_502_5) H6(PS_DDR_VREF0_502_1) H7(GND) H8(VCCPAUX_3) H9(GND) H10(VCCBRAM_1) H11(GND) H12(VCCINT_8) H13(GND) H14(VCCO_35_3) H15(IO_L19P_T3_35) H16(IO_L13P_T2_MRCC_35) H17(IO_L13N_T2_MRCC_35) H18(IO_L14N_T2_AD4N_SRCC_35) H19(GND) H20(IO_L17N_T2_AD5N_35) J2(GND) J7(VCCPINT_5) J8(GND) J11(VCCAUX_6) J12(GND) J13(VCCINT_7) J14(IO_L20N_T3_AD6N_35) J15(IO_25_35) J16(IO_L24N_T3_AD15N_35) J17(VCCO_35_4) J18(IO_L14P_T2_AD4P_SRCC_35) J19(IO_L10N_T1_AD11N_35) J20(IO_L17P_T2_AD5P_35) K5(GND) K6(VCCO_0) K7(GND) K8(VCCPAUX_2) K11(GND) K12(VCCINT_6) K13(GND) K14(IO_L20P_T3_AD6P_35) K15(GND) K16(IO_L24P_T3_AD15P_35) K17(IO_L12P_T1_MRCC_35) K18(IO_L12N_T1_MRCC_35) K19(IO_L10P_T1_AD11P_35) K20(VCCO_35_5) L3(VCCO_DDR_502_6) L7(VCCPINT_4) L8(GND) L11(VCCAUX_5) L12(GND) L13(VCCINT_5) L14(IO_L22P_T3_AD7P_35) L15(IO_L22N_T3_AD7N_35) L16(IO_L11P_T1_SRCC_35) L17(IO_L11N_T1_SRCC_35) L18(GND) L19(IO_L9P_T1_DQS_AD3P_35) L20(IO_L9N_T1_DQS_AD3N_35) M1(GND) M7(GND) M8(VCCPAUX_1) M11(GND) M12(VCCINT_4) M13(GND) M14(IO_L23P_T3_35) M15(IO_L23N_T3_35) M16(VCCO_35_6) M17(IO_L8P_T1_AD10P_35) M18(IO_L8N_T1_AD10N_35) M19(IO_L7P_T1_AD2P_35) M20(IO_L7N_T1_AD2N_35) N4(GND) N7(VCCPINT_3) N8(GND) N9(VCCAUX_4) N10(GND) N11(VCCAUX_1) N12(GND) N13(VCCINT_3) N14(GND) N15(IO_L21P_T3_DQS_AD14P_35) N16(IO_L21N_T3_DQS_AD14N_35) N17(IO_L23P_T3_34) N18(IO_L13P_T2_MRCC_34) N19(VCCO_34_1) N20(IO_L14P_T2_SRCC_34) P2(VCCO_DDR_502_7) P6(PS_DDR_VREF0_502_2) P7(GND) P8(VCCPINT_2) P9(GND) P10(VCCAUX_3) P11(GND) P12(VCCINT_2) P13(GND) P14(IO_L6P_T0_34) P15(IO_L24P_T3_34) P16(IO_L24N_T3_34) P17(GND) P18(IO_L23N_T3_34) P19(IO_L13N_T2_MRCC_34) P20(IO_L14N_T2_SRCC_34) R5(VCCO_DDR_502_8) R7(VCCPINT_1) R8(GND) R9(VCCAUX_2) R12(GND) R13(VCCINT_1) R14(IO_L6N_T0_VREF_34) R15(VCCO_34_2) R16(IO_L19P_T3_34) R17(IO_L19N_T3_VREF_34) R18(IO_L20N_T3_34) R19(IO_0_34) R20(GND) T3(GND) T5(IO_L19P_T3_13) T7(GND) T8(VCCO_13_1) T9(IO_L12P_T1_MRCC_13) T10(IO_L1N_T0_34) T11(IO_L1P_T0_34) T12(IO_L2P_T0_34) T13(GND) T14(IO_L5P_T0_34) T15(IO_L5N_T0_34) T16(IO_L9P_T1_DQS_34) T17(IO_L20P_T3_34) T18(VCCO_34_3) T19(IO_25_34) T20(IO_L15P_T2_DQS_34) U1(VCCO_DDR_502_9) U5(IO_L19N_T3_VREF_13) U6(GND) U7(IO_L11P_T1_SRCC_13) U8(IO_L17N_T2_13) U9(IO_L17P_T2_13) U10(IO_L12N_T1_MRCC_13) U11(VCCO_13_2) U12(IO_L2N_T0_34) U13(IO_L3P_T0_DQS_PUDC_B_34) U14(IO_L11P_T1_SRCC_34) U15(IO_L11N_T1_SRCC_34) U16(GND) U17(IO_L9N_T1_DQS_34) U18(IO_L12P_T1_MRCC_34) U19(IO_L12N_T1_MRCC_34) U20(IO_L15N_T2_DQS_34) V4(VCCO_DDR_502_10) V5(IO_L6N_T0_VREF_13) V6(IO_L22P_T3_13) V7(IO_L11N_T1_SRCC_13) V8(IO_L15P_T2_DQS_13) V9(GND) V10(IO_L21N_T3_DQS_13) V11(IO_L21P_T3_DQS_13) V12(IO_L4P_T0_34) V13(IO_L3N_T0_DQS_34) V14(VCCO_34_4) V15(IO_L10P_T1_34) V16(IO_L18P_T2_34) V17(IO_L21P_T3_DQS_34) V18(IO_L21N_T3_DQS_34) V19(GND) V20(IO_L16P_T2_34) W2(GND) W6(IO_L22N_T3_13) W7(VCCO_13_3) W8(IO_L15N_T2_DQS_13) W9(IO_L16N_T2_13) W10(IO_L16P_T2_13) W11(IO_L18P_T2_13) W12(GND) W13(IO_L4N_T0_34) W14(IO_L8P_T1_34) W15(IO_L10N_T1_34) W16(IO_L18N_T2_34) W17(VCCO_34_5) W18(IO_L22P_T3_34) W19(IO_L22N_T3_34) W20(IO_L16N_T2_34) Y5(GND) Y6(IO_L13N_T2_MRCC_13) Y7(IO_L13P_T2_MRCC_13) Y8(IO_L14N_T2_SRCC_13) Y9(IO_L14P_T2_SRCC_13) Y10(VCCO_13_4) Y11(IO_L18N_T2_13) Y12(IO_L20P_T3_13) Y13(IO_L20N_T3_13) Y14(IO_L8N_T1_34) Y15(GND) Y16(IO_L7P_T1_34) Y17(IO_L7N_T1_34) Y18(IO_L17P_T2_34) Y19(IO_L17N_T2_34) Y20(VCCO_34_6)

### Notes on the sheet
- Перв. примен.
- Справ. №
- Подп. и дата
- Инв. № дубл.
- Взам. инв. №
- Инв. № подл.
- Изм.
- Лист
- № докум.
- Подп.
- Дата
- 2.106-A2
- Копировал
- Формат А1
- (in symbol XC7Z020_CLG400ABX22, part B) BANK500
- (in symbol XC7Z020_CLG400ABX22, part C) BANK501
- (in symbol XC7Z020_CLG400ABX22, part E) BANK34
- (in symbol XC7Z020_CLG400ABX22, part F) BANK35
- (in symbol XC7Z020_CLG400ABX22, part G) BANK13
- (in symbol XC7Z020_CLG400ABX22, part H) IO/CORE; POWER

### Library data of the parts
D7 = XC7Z020_CLG400ABX22: as D7 on sheet XX_FPGA_BANK502; HelpURL: https://www.lcsc.com/product-detail/Programmable-Logic-Device-CPLDs-FPGAs_AMD-XILINX-XC7Z020-2CLG400I_C569043.html; Package: CSPBGA-400; ComponentType: IC FPGA; Temperature: 0...+85°C; Series: Zynq

## Nets that join several sheets
DDR3_VDD: XX_DDR3 (72 pins), XX_FPGA_BANK502 (R21.1)
GND: XX_DDR3 (81 pins), XX_FPGA_BANK502 (R23.2)
DDR3_A0: XX_DDR3 (D3.N3 D6.N3 R?#1.6), XX_FPGA_BANK502 (D7.N2)
DDR3_A1: XX_DDR3 (D3.P7 D6.P7 R?#3.4), XX_FPGA_BANK502 (D7.K2)
DDR3_A2: XX_DDR3 (D3.P3 D6.P3 R?#1.2), XX_FPGA_BANK502 (D7.M3)
DDR3_A3: XX_DDR3 (D3.N2 D6.N2 R?#5.6), XX_FPGA_BANK502 (D7.K3)
DDR3_A4: XX_DDR3 (D3.P8 D6.P8 R?#4.4), XX_FPGA_BANK502 (D7.M4)
DDR3_A5: XX_DDR3 (D3.P2 D6.P2 R?#1.4), XX_FPGA_BANK502 (D7.L1)
DDR3_A6: XX_DDR3 (D3.R8 D6.R8 R?#7.8), XX_FPGA_BANK502 (D7.L4)
DDR3_A7: XX_DDR3 (D3.R2 D6.R2 R?#7.2), XX_FPGA_BANK502 (D7.K4)
DDR3_A8: XX_DDR3 (D3.T8 D6.T8 R?#4.2), XX_FPGA_BANK502 (D7.K1)
DDR3_A9: XX_DDR3 (D3.R3 D6.R3 R?#7.4), XX_FPGA_BANK502 (D7.J4)
DDR3_A10: XX_DDR3 (D3.L7 D6.L7 R?#6.8), XX_FPGA_BANK502 (D7.F5)
DDR3_A11: XX_DDR3 (D3.R7 D6.R7 R?#3.6), XX_FPGA_BANK502 (D7.G4)
DDR3_A12: XX_DDR3 (D3.N7 D6.N7 R?#3.2), XX_FPGA_BANK502 (D7.E4)
DDR3_A13: XX_DDR3 (D3.T3 D6.T3 R?#7.6), XX_FPGA_BANK502 (D7.D4)
DDR3_A14: XX_DDR3 (D3.T7 D6.T7 R?#3.8), XX_FPGA_BANK502 (D7.F4)
DDR3_BA0: XX_DDR3 (D3.M2 D6.M2 R?#1.8), XX_FPGA_BANK502 (D7.L5)
DDR3_BA1: XX_DDR3 (D3.N8 D6.N8 R?#4.6), XX_FPGA_BANK502 (D7.R4)
DDR3_BA2: XX_DDR3 (D3.M3 D6.M3 R?#5.4), XX_FPGA_BANK502 (D7.J5)
DDR3_CK_N: XX_DDR3 (D3.K7 D6.K7), XX_FPGA_BANK502 (D7.M2 R22.1)
DDR3_CK_P: XX_DDR3 (D3.J7 D6.J7), XX_FPGA_BANK502 (D7.L2 R22.2)
DDR3_CKE: XX_DDR3 (D3.K9 D6.K9 R?#4.8), XX_FPGA_BANK502 (D7.N3)
DDR3_DM0: XX_DDR3 (D6.E7), XX_FPGA_BANK502 (D7.A1)
DDR3_DM1: XX_DDR3 (D6.D3), XX_FPGA_BANK502 (D7.F1)
DDR3_DM2: XX_DDR3 (D3.E7), XX_FPGA_BANK502 (D7.T1)
DDR3_DM3: XX_DDR3 (D3.D3), XX_FPGA_BANK502 (D7.Y1)
DDR3_DQ0: XX_DDR3 (D6.E3), XX_FPGA_BANK502 (D7.C3)
DDR3_DQ1: XX_DDR3 (D6.F7), XX_FPGA_BANK502 (D7.B3)
DDR3_DQ2: XX_DDR3 (D6.F2), XX_FPGA_BANK502 (D7.A2)
DDR3_DQ3: XX_DDR3 (D6.F8), XX_FPGA_BANK502 (D7.A4)
DDR3_DQ4: XX_DDR3 (D6.H3), XX_FPGA_BANK502 (D7.D3)
DDR3_DQ5: XX_DDR3 (D6.H8), XX_FPGA_BANK502 (D7.D1)
DDR3_DQ6: XX_DDR3 (D6.G2), XX_FPGA_BANK502 (D7.C1)
DDR3_DQ7: XX_DDR3 (D6.H7), XX_FPGA_BANK502 (D7.E1)
DDR3_DQ8: XX_DDR3 (D6.D7), XX_FPGA_BANK502 (D7.E2)
DDR3_DQ9: XX_DDR3 (D6.C3), XX_FPGA_BANK502 (D7.E3)
DDR3_DQ10: XX_DDR3 (D6.C8), XX_FPGA_BANK502 (D7.G3)
DDR3_DQ11: XX_DDR3 (D6.C2), XX_FPGA_BANK502 (D7.H3)
DDR3_DQ12: XX_DDR3 (D6.A7), XX_FPGA_BANK502 (D7.J3)
DDR3_DQ13: XX_DDR3 (D6.A2), XX_FPGA_BANK502 (D7.H2)
DDR3_DQ14: XX_DDR3 (D6.B8), XX_FPGA_BANK502 (D7.H1)
DDR3_DQ15: XX_DDR3 (D6.A3), XX_FPGA_BANK502 (D7.J1)
DDR3_DQ16: XX_DDR3 (D3.E3), XX_FPGA_BANK502 (D7.P1)
DDR3_DQ17: XX_DDR3 (D3.F7), XX_FPGA_BANK502 (D7.P3)
DDR3_DQ18: XX_DDR3 (D3.F2), XX_FPGA_BANK502 (D7.R3)
DDR3_DQ19: XX_DDR3 (D3.F8), XX_FPGA_BANK502 (D7.R1)
DDR3_DQ20: XX_DDR3 (D3.H3), XX_FPGA_BANK502 (D7.T4)
DDR3_DQ21: XX_DDR3 (D3.H8), XX_FPGA_BANK502 (D7.U4)
DDR3_DQ22: XX_DDR3 (D3.G2), XX_FPGA_BANK502 (D7.U2)
DDR3_DQ23: XX_DDR3 (D3.H7), XX_FPGA_BANK502 (D7.U3)
DDR3_DQ24: XX_DDR3 (D3.D7), XX_FPGA_BANK502 (D7.V1)
DDR3_DQ25: XX_DDR3 (D3.C3), XX_FPGA_BANK502 (D7.Y3)
DDR3_DQ26: XX_DDR3 (D3.C8), XX_FPGA_BANK502 (D7.W1)
DDR3_DQ27: XX_DDR3 (D3.C2), XX_FPGA_BANK502 (D7.Y4)
DDR3_DQ28: XX_DDR3 (D3.A7), XX_FPGA_BANK502 (D7.Y2)
DDR3_DQ29: XX_DDR3 (D3.A2), XX_FPGA_BANK502 (D7.W3)
DDR3_DQ30: XX_DDR3 (D3.B8), XX_FPGA_BANK502 (D7.V2)
DDR3_DQ31: XX_DDR3 (D3.A3), XX_FPGA_BANK502 (D7.V3)
DDR3_DQS0_N: XX_DDR3 (D6.G3), XX_FPGA_BANK502 (D7.B2)
DDR3_DQS0_P: XX_DDR3 (D6.F3), XX_FPGA_BANK502 (D7.C2)
DDR3_DQS1_N: XX_DDR3 (D6.B7), XX_FPGA_BANK502 (D7.F2)
DDR3_DQS1_P: XX_DDR3 (D6.C7), XX_FPGA_BANK502 (D7.G2)
DDR3_DQS2_N: XX_DDR3 (D3.G3), XX_FPGA_BANK502 (D7.T2)
DDR3_DQS2_P: XX_DDR3 (D3.F3), XX_FPGA_BANK502 (D7.R2)
DDR3_DQS3_N: XX_DDR3 (D3.B7), XX_FPGA_BANK502 (D7.W4)
DDR3_DQS3_P: XX_DDR3 (D3.C7), XX_FPGA_BANK502 (D7.W5)
DDR3_nCAS: XX_DDR3 (D3.K3 D6.K3 R?#6.4), XX_FPGA_BANK502 (D7.P5)
DDR3_nCS: XX_DDR3 (D3.L2 D6.L2 R?#5.2), XX_FPGA_BANK502 (D7.N1)
DDR3_nRAS: XX_DDR3 (D3.J3 D6.J3 R?#6.6), XX_FPGA_BANK502 (D7.P4)
DDR3_nWE: XX_DDR3 (D3.L3 D6.L3 R?#5.8), XX_FPGA_BANK502 (D7.M5)
DDR3_ODT: XX_DDR3 (D3.K1 D6.K1 R?#6.2), XX_FPGA_BANK502 (D7.N5)